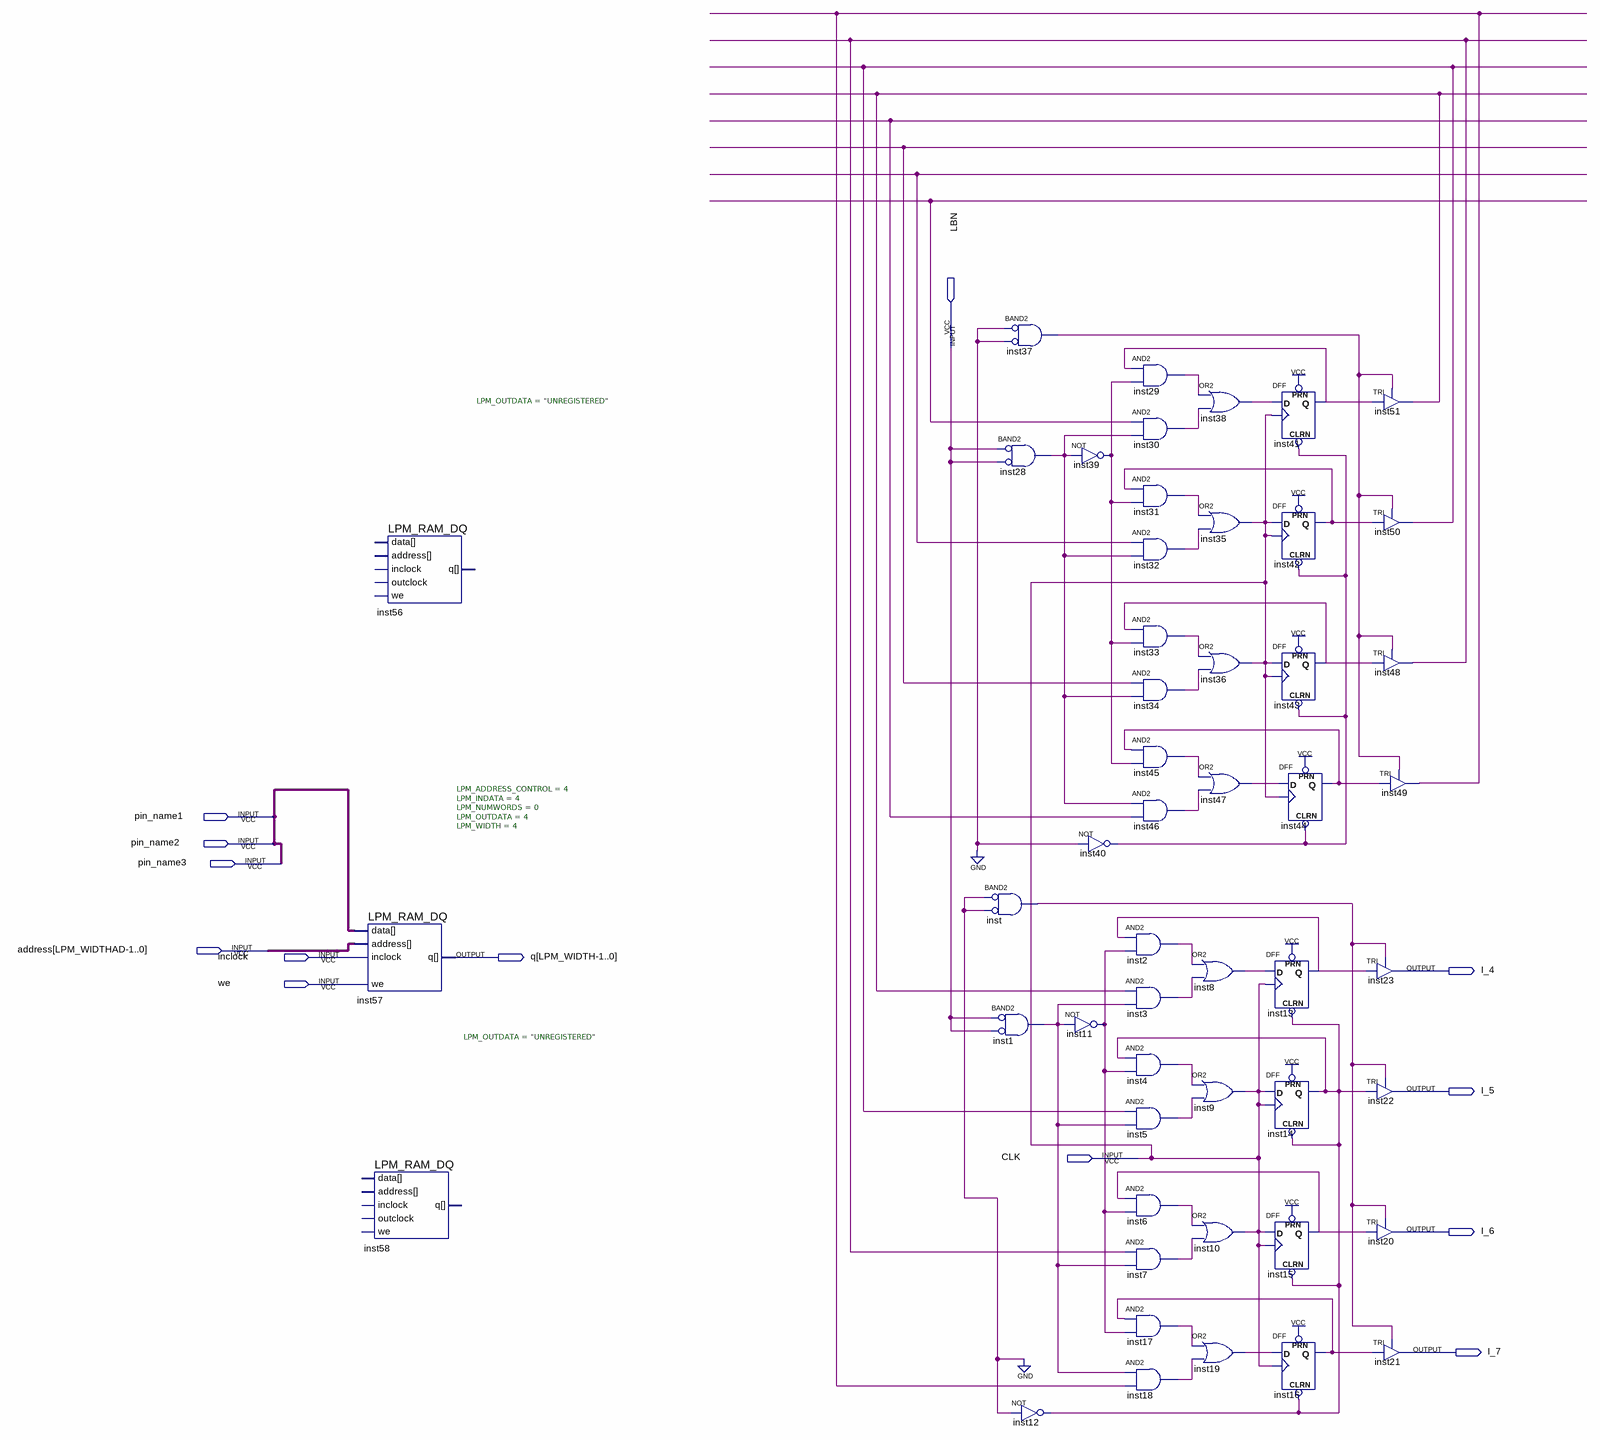
[diagram p0: schematic sheet]
// Quartus schematic Memoria_RAM_REM.bdf as structural Verilog: 51 symbols, 13 pins
module Memoria_RAM_REM (
  input  LBN,
  input  pin_name1,
  input  pin_name2,
  input  pin_name3,
  input  \address[LPM_WIDTHAD-1..0] ,
  input  inclock,
  input  we,
  input  CLK,
  output \q[LPM_WIDTH-1..0] ,
  output I_4,
  output I_5,
  output I_6,
  output I_7
);

  wire inst1_out, inst2_out, inst3_out, inst4_out, inst5_out, inst6_out, inst7_out, inst8_out, inst11_out,
       inst12_out, inst13_q, inst15_q, inst16_q, inst17_out, inst18_out, inst19_out, inst28_out, inst29_out,
       inst30_out, inst31_out, inst32_out, inst33_out, inst34_out, inst37_out, inst38_out, inst39_out,
       inst40_out, inst41_q, inst42_q, inst43_q, inst44_q, inst45_out, inst46_out, inst47_out, inst48_out,
       inst49_out, inst50_out, inst51_out, inst_out, undriven, undriven_2, undriven_3, undriven_4;
  wire [3:0] undriven_5;

  LPM_RAM_DQ #(.LPM_ADDRESS_CONTROL(4), .LPM_INDATA(4), .LPM_NUMWORDS(0), .LPM_OUTDATA(4), .LPM_WIDTH(4)) inst57 (
    .address(\address[LPM_WIDTHAD-1..0] ), .data(undriven_5), .inclock(inclock), .we(we),
    .q(\q[LPM_WIDTH-1..0] ));
  LPM_RAM_DQ #(.LPM_OUTDATA("UNREGISTERED")) inst58 ();  // open: inclock, data, address, we, outclock, q
  LPM_RAM_DQ #(.LPM_OUTDATA("UNREGISTERED")) inst56 ();  // open: inclock, data, address, we, outclock, q
  and inst37 (inst37_out, ~1'b0, ~1'b0);  // BAND2
  and inst28 (inst28_out, ~LBN, ~LBN);  // BAND2
  and inst (inst_out, ~1'b0, ~1'b0);  // BAND2
  and inst1 (inst1_out, ~LBN, ~LBN);  // BAND2
  not inst12 (inst12_out, 1'b0);
  not inst11 (inst11_out, inst1_out);
  not inst39 (inst39_out, inst28_out);
  not inst40 (inst40_out, 1'b0);
  and inst29 (inst29_out, inst41_q, inst39_out);
  and inst30 (inst30_out, undriven, inst28_out);
  and inst31 (inst31_out, inst42_q, inst39_out);
  and inst32 (inst32_out, undriven_2, inst28_out);
  and inst33 (inst33_out, inst43_q, inst39_out);
  and inst34 (inst34_out, undriven_3, inst28_out);
  and inst45 (inst45_out, inst44_q, inst39_out);
  and inst46 (inst46_out, inst28_out, undriven_4);
  and inst2 (inst2_out, inst13_q, inst11_out);
  and inst3 (inst3_out, inst51_out, inst1_out);
  and inst4 (inst4_out, inst12_out, inst11_out);
  and inst5 (inst5_out, inst50_out, inst1_out);
  and inst6 (inst6_out, inst15_q, inst11_out);
  and inst7 (inst7_out, inst48_out, inst1_out);
  and inst17 (inst17_out, inst16_q, inst11_out);
  and inst18 (inst18_out, inst1_out, inst49_out);
  or inst38 (inst38_out, inst29_out, inst30_out);
  or inst35 (CLK, inst31_out, inst32_out);
  or inst36 (CLK, inst33_out, inst34_out);
  or inst47 (inst47_out, inst45_out, inst46_out);
  or inst8 (inst8_out, inst2_out, inst3_out);
  or inst9 (CLK, inst4_out, inst5_out);
  or inst10 (CLK, inst6_out, inst7_out);
  or inst19 (inst19_out, inst17_out, inst18_out);
  DFF inst41 (.CLRN(inst40_out), .CLK(CLK), .D(inst38_out), .PRN(1'b1), .Q(inst41_q));
  DFF inst42 (.CLRN(inst40_out), .CLK(CLK), .D(CLK), .PRN(1'b1), .Q(inst42_q));
  DFF inst43 (.CLRN(inst40_out), .CLK(CLK), .D(CLK), .PRN(1'b1), .Q(inst43_q));
  DFF inst44 (.CLRN(inst40_out), .CLK(CLK), .D(inst47_out), .PRN(1'b1), .Q(inst44_q));
  DFF inst13 (.CLRN(inst12_out), .CLK(CLK), .D(inst8_out), .PRN(1'b1), .Q(inst13_q));
  DFF inst14 (.CLRN(inst12_out), .CLK(CLK), .D(CLK), .PRN(1'b1), .Q(inst12_out));
  DFF inst15 (.CLRN(inst12_out), .CLK(CLK), .D(CLK), .PRN(1'b1), .Q(inst15_q));
  DFF inst16 (.CLRN(inst12_out), .CLK(CLK), .D(inst19_out), .PRN(1'b1), .Q(inst16_q));
  TRI inst51 (.IN(inst41_q), .OE(inst37_out), .OUT(inst51_out));
  TRI inst50 (.IN(inst42_q), .OE(inst37_out), .OUT(inst50_out));
  TRI inst48 (.IN(inst43_q), .OE(inst37_out), .OUT(inst48_out));
  TRI inst49 (.IN(inst44_q), .OE(inst37_out), .OUT(inst49_out));
  TRI inst23 (.IN(inst13_q), .OE(inst_out), .OUT(I_4));
  TRI inst22 (.IN(inst12_out), .OE(inst_out), .OUT(I_5));
  TRI inst20 (.IN(inst15_q), .OE(inst_out), .OUT(I_6));
  TRI inst21 (.IN(inst16_q), .OE(inst_out), .OUT(I_7));
endmodule
